# EAGLE design J-ST-Link (EAGLE 9.6.2)
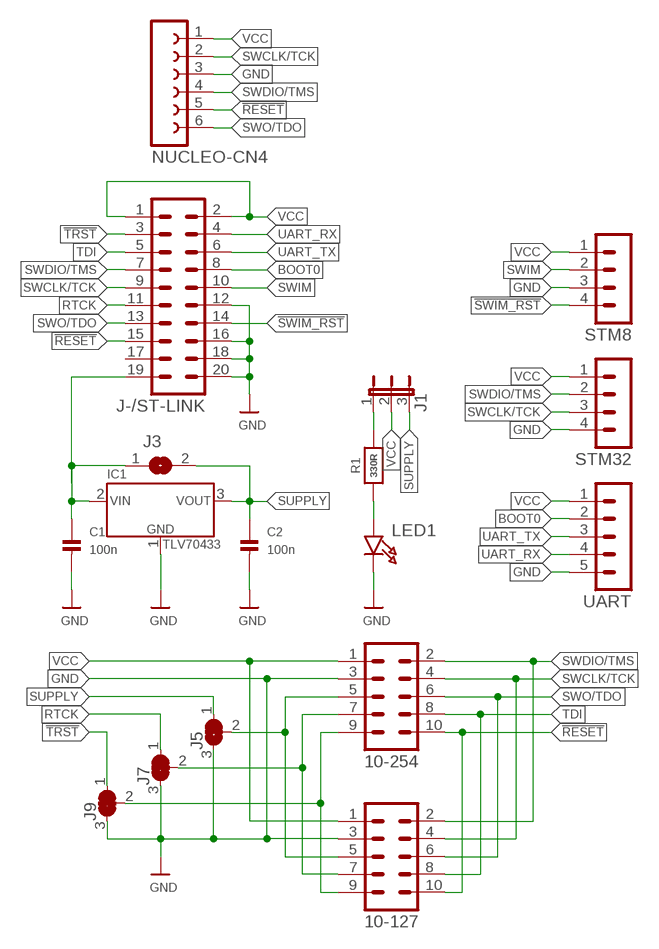
[diagram p0: schematic, sheet 1]

## Parts
10-127  CON-HARTING-ML_ML10S  [CON-HARTING-ML_ML10S]
10-254  ML10  [ML10]
C1  100n  CAP_CERAMIC_0603MP  [_0603MP]
C2  100n  CAP_CERAMIC_0603MP  [_0603MP]
IC1  TLV70433  TLV704XX  [SOT23-5]
J1  JUMPER3LONG  [JUMPER3_LONG]
J3  SOLDERJUMPERSMALL_NOPRINT  [SOLDERJUMPER_SMALL_NOPRINT]
J5  SOLDERJUMPER_2WAY_CLOSED  [SOLDERJUMPER_2WAY_CLOSED_0603]
J7  SOLDERJUMPER_2WAY_CLOSED  [SOLDERJUMPER_2WAY_CLOSED_0603]
J9  SOLDERJUMPER_2WAY_CLOSED  [SOLDERJUMPER_2WAY_CLOSED_0603]
J-/ST-LINK  ML20  [ML20]
LED1  LED0603_NOOUTLINE  [CHIPLED_0603_NOOUTLINE]
NUCLEO-CN4  FE06WSQUARE  [FE06W_SQUARE]
R1  330R  RESISTOR_0603_NOOUT  [0603-NO]
STM8  MA04-1  [MA04-1]
STM32  MA04-1  [MA04-1]
UART  MA05-1  [MA05-1]

## Nets
!RESET: 10-127.10 10-254.10 J-/ST-LINK.15 NUCLEO-CN4.5
!SWIM_RST: J-/ST-LINK.14 STM8.4
!TRST: J9.1 J-/ST-LINK.3
BOOT0: J-/ST-LINK.8 UART.2
GND: 10-127.3 10-254.3 C1.2 C2.2 IC1.1(GND) J5.3 J7.3 J9.3 J-/ST-LINK.12 J-/ST-LINK.16 J-/ST-LINK.18 J-/ST-LINK.20 LED1.C NUCLEO-CN4.3 STM8.3 STM32.4 UART.5
N$36: LED1.A R1.1
N$49: J1.1 R1.2
RTCK: J7.1 J-/ST-LINK.11
RTCK/NC/GND: 10-127.7 10-254.7 J7.2
SUPPLY: C2.1 IC1.3(OUT) J1.3 J3.2 J5.1
SUPPLY/NC/GND: 10-127.5 10-254.5 J5.2
SUPPLY_IN: C1.1 IC1.2(IN) J3.1 J-/ST-LINK.19
SWCLK/TCK: 10-127.4 10-254.4 J-/ST-LINK.9 NUCLEO-CN4.2 STM32.3
SWDIO/TMS: 10-127.2 10-254.2 J-/ST-LINK.7 NUCLEO-CN4.4 STM32.2
SWIM: J-/ST-LINK.10 STM8.2
SWO/TDO: 10-127.6 10-254.6 J-/ST-LINK.13 NUCLEO-CN4.6
TDI: 10-127.8 10-254.8 J-/ST-LINK.5
TRST/NC/GND: 10-127.9 10-254.9 J9.2
UART_RX: J-/ST-LINK.4 UART.4
UART_TX: J-/ST-LINK.6 UART.3
VCC: 10-127.1 10-254.1 J1.2 J-/ST-LINK.1 J-/ST-LINK.2 NUCLEO-CN4.1 STM8.1 STM32.1 UART.1
Unconnected: J-/ST-LINK.17

## Library data of the parts
10-127 = Progger2 (3):CON-HARTING-ML_ML10: HARTING
10-254 = con-harting-ml:ML10: HARTING; OC_FARNELL: unknown; OC_NEWARK: unknown
C1 C2 = microbuilder:CAP_CERAMIC: Ceramic Capacitors 0402 - 0402 Surface Mount Capacitors 16pF 50V 5% [Digikey: 445-4899-2-ND] 18pF 50V 5% [Digikey: 490-1281-2-ND] 22pF 50V 5% [Digikey: 490-1283-2-ND] 68pF 50V 5% [Digikey: 490-1289-2-ND] 0.1uF 10V 10% [Digikey: 490-1318-2-ND] 1.0uF 6.3V 10% [Digikey: 490-1320-2-ND] 0603 - 0603 Surface Mount Capacitors 16 pF 50V 5% [Digikey: 445-5051-2-ND] 22 pF 50V [Digikey: PCC220ACVTR-ND] 33 pF 50V 5% [Digikey: 490-1415-1-ND] 56pF 50V 5% [Digikey: 490-1421-1-ND] 220pF 50V 5% [Digikey: 445-1285-1-ND] 680 pF 50V 2200 pF 50V 5% C0G [Digikey: 445-1297-1-ND] 5600 pF 100V 5% X7R [Digikey: 478-3711-1-ND] 0.1 µF 25V 10% [Digikey: PCC2277TR-ND] 0.22 µF 16V 10% X7R [Digikey: 445-1318-1-ND] 1.0 µF 25V 10% [Digikey: 445-5146-2-ND] 0603 - RF Specific 3pF 250V +/-0.1pF RF [Digikey: 712-1347-1-ND] 18 pF 250V 5% [Digikey: 478-3505-1-ND or 712-1322-1-ND] 56 pF 250V 5% C0G RF [Digikey: 490-4867-1-ND] 68 pF 250V RF [Digikey: 490-4868-1-ND] 0805 - 0805 Surface Mount Capacitors 220 pF 250V 2% RF Ceramic Capacitor [Digikey: 712-1398-1-ND] 1000 pF 50V 2% NP0 Ceramic Capacitor [Digikey: 478-3760-1-ND] 0.1 µF 25V 10% Ceramic Capacitor [Digikey: PCC1828TR-ND] 1.0 µF 16V 10% Ceramic Capacitor[Digikey: 490-1691-2-ND] 10.0 µF 10V 10% Ceramic Capacitor[Digikey: 709-1228-1-ND] 10.0 uF 16V 10% Ceramic Capacitor [Digikey: 478-5165-2-ND] 47 uF 6.3V 20% Ceramic Capacitor [Digikey: 587-1779-1-ND or 399-5506-1-ND] 1206 - 1206 Surface Mount Capacitors 47uF 10V 20% Ceramic Capacitor [Digikey: 490-5528-1-ND or 399-5508-1-ND or 445-6010-1-ND] 100uF 6.3V -20%, +80% Y5V Ceramic Capacitor (Digikey: 490-4512-1-ND, Mouser: 81-GRM31CF50J107ZE1L)
IC1 = microbuilder:TLV704XX
J1 = microbuilder:JUMPER3: JUMPER - 3 Pins
J3 = microbuilder:SOLDERJUMPER: SMD Solder JUMPER Solder the two pads together to create a connection, or remove the solder to break it. REFLOW - Use this footprint for solder paste and reflow ovens. WAVE - Use this footprint for hand-soldering (larger pads). CLOSED - Has a trace between the two pads to ensure it is closed by default. The trace needs to be cut to disable the jumper, and can be closed again by creating a solder bridge between the two pads.
J5 J7 J9 = microbuilder:SOLDERJUMPER_2WAY_CLOSED
J-/ST-LINK = con-harting-ml:ML20: HARTING; OC_FARNELL: unknown; OC_NEWARK: unknown
LED1 = microbuilder:LED: LED 0603 - 0603 Surface Mount Package 2mA: Green LED - Low Power (3.9mcd, 2ma, 1.7Vf) - Digikey: 475-2709-2-ND Orange LED - Low Power (9.8mcd, 2ma, 1.8Vf) - Digikey: 475-1194-2-ND Red LED - Low Power (5mcd, 2ma, 1.8Vf) - Digikey: 475-1195-2-ND Yellow LED - Low Power (7mcd, 2ma, 1.8Vf) - Digikey: 475-1196-2-ND 5mA: Blue LED - Low Power (17mcd, 5ma, 2.9Vf) - Digikey: LNJ937W8CRACT-ND 0805 - 0805 Surface Mount Package 2mA: Red LED (8.8mcd, 2mA, 1.8Vf, Clear) - Low Power [Digikey: 475-2510-1-ND] Green LED (5mcd, 2mA, 1.8Vf, Clear) - Low Power [Digikey: 475-2730-1-ND] Yellow LED (11.3mcd, 2mA, 1.8Vf, Clear) - Low Power [Digikey: 475-2555-1-ND] 20mA: Red LED (104mcd, 20mA, Diffused) - LS R976 [Digikey: 475-1278-6-ND] Red LED (12mcd, 20mA, 2.0Vf, Clear) - APT2012EC [Digikey: 754-1128-1-ND] Green LED (15mcd, 20mA, 2.2Vf, Clear) - APT2012GC [Digikey: 754-1131-1-ND] Orange LED (160mcd, 20mA, 2.1Vf, Clear) - APT2012SECK [Digikey: 754-1130-1-ND] 1206 - 1206 Surface Mount Package Green LED (26mcd, 20mA, Diffused) - LG N971 [Digikey: 475-1407-6-ND] Red LED (15mcd, 20mA, Diffused) - LH N974 [Digikey: 475-1416-6-ND]
NUCLEO-CN4 = con-lsta_edit:FE06W: FEMALE HEADER
R1 = microbuilder:RESISTOR: Resistors For new designs, use the packages preceded by an '_' character since they are more reliable: The following footprints should be used on most boards: _0402 - Standard footprint for regular board layouts _0603 - Standard footprint for regular board layouts _0805 - Standard footprint for regular board layouts _1206 - Standard footprint for regular board layouts For extremely tight-pitch boards where space is at a premium, the following 'micro-pitch' footprints can be used (smaller pads, no silkscreen outline, etc.): _0402MP - Micro-pitch footprint for very dense/compact boards _0603MP - Micro-pitch footprint for very dense/compact boards _0805MP - Micro-pitch footprint for very dense/compact boards _1206MP - Micro-pitch footprint for very dense/compact boards
STM8 STM32 = con-lstb:MA04-1: PIN HEADER; OC_FARNELL: unknown; OC_NEWARK: unknown
UART = con-lstb:MA05-1: PIN HEADER; OC_FARNELL: unknown; OC_NEWARK: unknown

## Board
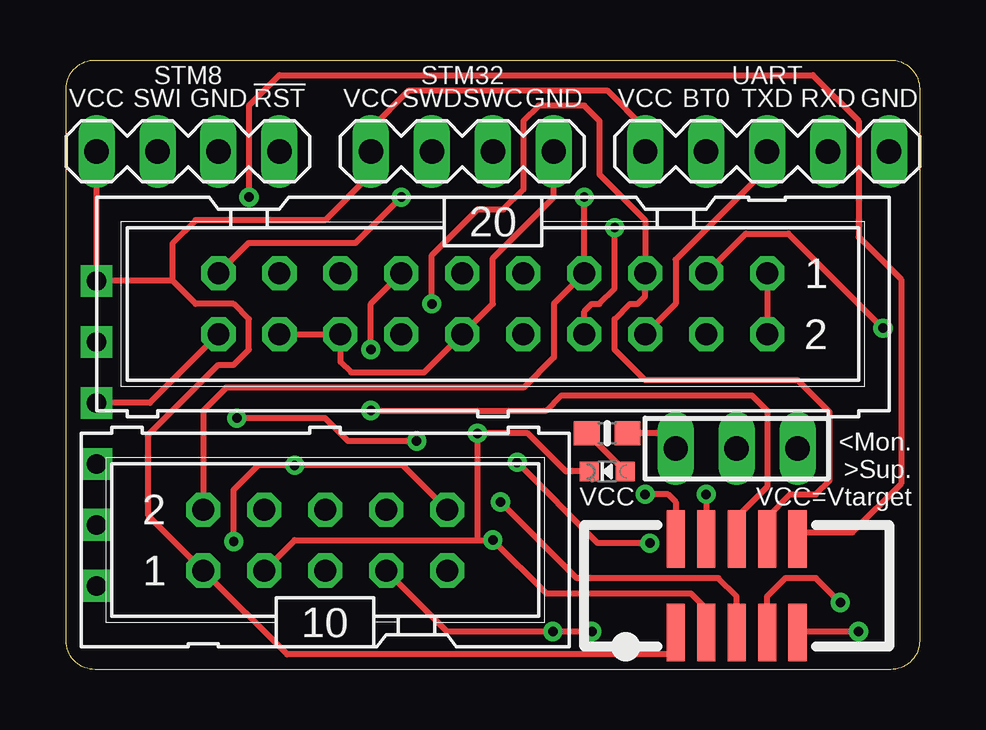
[diagram p1: board, top side]
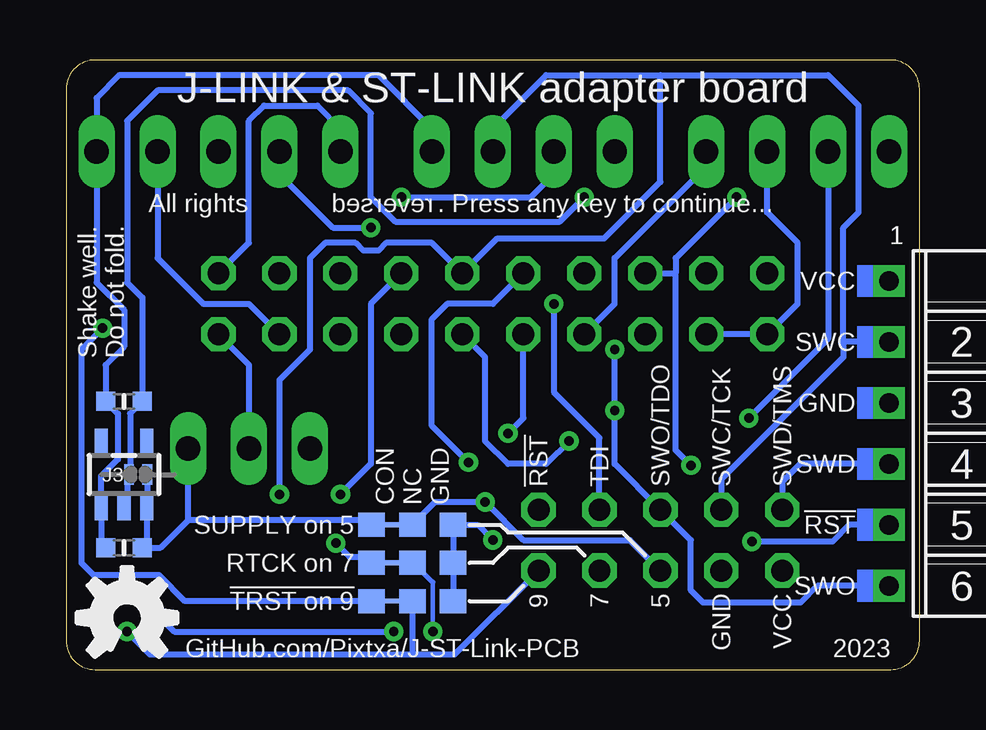
[diagram p2: board, bottom side, seen from below]

Size 35.56 x 25.4 mm. Coordinates in mm from the lower left corner, seen from the top.
Outline: 34.35,25.4 arc-90 35.56,24.19 35.56,1.21 arc-90 34.35,0 1.21,0 arc-90 0,1.21 0,24.19 arc-90 1.21,25.4 34.35,25.4
Copper layers (1*16): Top 0.035mm / dielectric 1.5mm / Bottom 0.035mm
Design rules "adafruit 88": minimum track width 8mil, minimum drill 15.5mil, track to track 8mil, track to pad 8mil, pad to pad 8mil, via to via 8mil, smd to smd 8mil, copper to edge 10mil, drill to drill 8mil, minimum pad ring 10mil, minimum via ring 8mil, stop-mask expansion 2mil, vias tented up to drill 20mil, thermal gap 10mil

### Footprints (pad centres in the part's own frame; a part is rotated, then mirrored left to right if it is on the bottom)
CON-HARTING-ML_ML10S = smd 0.76 x 2.4: 1 -2.54,-1.95; 2 -2.54,1.95; 3 -1.27,-1.95; 4 -1.27,1.95; 5 0,-1.95; 6 0,1.95; 7 1.27,-1.95; 8 1.27,1.95; 9 2.54,-1.95; 10 2.54,1.95
ML10 = drill 0.914 octagon: 1 -5.08,-1.27; 2 -5.08,1.27; 3 -2.54,-1.27; 4 -2.54,1.27; 5 0,-1.27; 6 0,1.27; 7 2.54,-1.27; 8 2.54,1.27; 9 5.08,-1.27; 10 5.08,1.27
_0603MP = smd 0.8 x 0.8: 1 -0.762,0; 2 0.762,0
SOT23-5 = smd 0.55 x 1.2: 1 -0.95,-1.3; 2 0,-1.3; 3 0.95,-1.3; 4 0.95,1.3; 5 -0.95,1.3
JUMPER3_LONG = drill 1.016 long: 1 -2.54,0; 2 0,0; 3 2.54,0
SOLDERJUMPER_SMALL_NOPRINT = smd 0.406 x 0.838: 1 -0.381,0; 2 0.381,0
SOLDERJUMPER_2WAY_CLOSED_0603 = smd 1.1 x 1: 1 -1.7,0; 2 0,0; 3 1.7,0 | smd 1 x 0.203: WIRE -0.85,0
ML20 = drill 0.914 octagon: 1 -11.43,-1.27; 2 -11.43,1.27; 3 -8.89,-1.27; 4 -8.89,1.27; 5 -6.35,-1.27; 6 -6.35,1.27; 7 -3.81,-1.27; 8 -3.81,1.27; 9 -1.27,-1.27; 10 -1.27,1.27; 11 1.27,-1.27; 12 1.27,1.27; 13 3.81,-1.27; 14 3.81,1.27; 15 6.35,-1.27; 16 6.35,1.27; 17 8.89,-1.27; 18 8.89,1.27; 19 11.43,-1.27; 20 11.43,1.27
CHIPLED_0603_NOOUTLINE = smd 0.8 x 0.8: A 0,-0.75; C 0,0.75
FE06W_SQUARE = drill 0.813 square: 1 -6.35,0; 2 -3.81,0; 3 -1.27,0; 4 1.27,0; 5 3.81,0; 6 6.35,0
0603-NO = smd 1.075 x 1: 1 -0.85,0; 2 0.85,0
MA04-1 = drill 1.016 long: 1 -3.81,0; 2 -1.27,0; 3 1.27,0; 4 3.81,0
MA05-1 = drill 1.016 long: 1 -5.08,0; 2 -2.54,0; 3 0,0; 4 2.54,0; 5 5.08,0

### Placement (x,y rotation side)
10-127  27.94,3.49 0 top
10-254  10.79,5.4 0 top
C1  33.15,11.18 180 bottom
C2  33.15,5.08 180 bottom
IC1  33.15,8.13 0 bottom
J1  27.94,9.21 0 top
J3  32.56,8.13 0 bottom
J5  21.13,6.03 0 bottom
J7  21.13,4.45 0 bottom
J9  21.13,2.86 0 bottom
J-/ST-LINK  17.78,15.24 180 top
LED1  22.54,8.26 90 top
NUCLEO-CN4  1.27,9.84 270 bottom
R1  22.54,9.84 0 top
STM8  5.08,21.59 0 top
STM32  16.51,21.59 0 top
UART  29.21,21.59 0 top

### Tracks (layer width: path | path; a pad name or v marks a point on that pad's centre or on a via)
!RESET  (via drill 0.39)
  Top 0.254: v7.62,19.68 7.62,23.5 8.89,24.77 31.11,24.77 33.02,22.86 33.02,18.03 34.8,16.26 34.8,7.75 32.77,5.71 30.48,5.71 10-127.10 | 10-254.10 14.03,8.51 v9.53,8.51 8,8.51 6.99,7.49 v6.99,5.33
  Bottom 0.254: v7.62,19.68 10.16,17.14 10.16,16.51 | J-/ST-LINK.15 10.16,16.51 | v9.53,8.51 10.16,9.14 10.16,16.51 | NUCLEO-CN4.5 2.92,6.03 3.62,5.33 v6.99,5.33
!SWIM_RST
  Bottom 0.254: J-/ST-LINK.14 12.7,15.24 12.7,17.14 9.21,20.64 8.89,20.64 STM8.4
!TRST  (via drill 0.39)
  Top 0.254: J-/ST-LINK.3 28.32,18.16 30.1,18.16 v34.04,14.22
  Bottom 0.254: v34.04,14.22 34.92,13.34 34.92,4.45 34.42,3.94 31.69,3.94 30.61,2.86 J9.1
BOOT0  (via drill 0.39)
  Top 0.254: J-/ST-LINK.8 21.59,14.92 21.91,15.24 22.23,15.24 22.86,15.88 v22.86,18.41
  Bottom 0.254: UART.2 26.67,20.64 24.45,18.41 v22.86,18.41
GND  (via drill 0.39)
  Top 0.254: 10-127.3 26.67,2.54 26.04,3.17 20,3.17 v17.78,5.4 17.14,5.4 | J-/ST-LINK.18 J-/ST-LINK.16 11.43,12.83 11.87,12.38 14.92,12.38 J-/ST-LINK.12 17.78,15.24 17.78,17.14 20.32,19.68 STM32.4 | LED1.C 20.83,8.26 19.24,9.84 v17.14,9.84 17.14,5.4 | J-/ST-LINK.20 3.49,11.11 NUCLEO-CN4.3 | 10-254.3 9.53,5.4 17.14,5.4
  Bottom 0.254: STM8.3 6.35,19.05 5.08,17.78 5.08,15.24 J-/ST-LINK.20 J-/ST-LINK.18 | STM32.4 20.32,22.54 22.54,24.77 33.34,24.77 34.29,23.81 UART.5 34.29,16.13 33.15,14.99 33.15,13.46 33.91,12.7 C1.2 33.4,10.67 33.4,8.76 34.1,8.07 IC1.1 34.1,5.27 C2.2 | v17.14,9.84 16.51,10.48 J-/ST-LINK.12 | v17.78,5.4 18.41,6.03 J5.3 J7.3 J9.3
N$36
  Top 0.254: LED1.A 21.7,9.84 R1.1
N$49
  Top 0.254: R1.2 23.5,9.84 25.4,9.84 J1.1
RTCK  (via drill 0.39)
  Top 0.254: v24.32,5.27 22.16,5.27 v18.8,8.64
  Bottom 0.254: J-/ST-LINK.11 17.78,15.24 19.68,15.24 20.32,14.61 20.32,10.16 v18.8,8.64 | v24.32,5.27 23.75,4.7 23.09,4.7 J7.1
RTCK/NC/GND  (via drill 0.39)
  Top 0.254: v32.26,2.79 31.24,3.81 29.97,3.81 29.21,3.05 10-127.7 | v21.91,1.59 v20.28,1.59 15.88,1.59 10-254.7
  Bottom 0.195: v20.28,1.59 20.28,3.64
  Bottom 0.199: 20.28,3.64 21.08,4.45
  Bottom 0.203: 21.08,4.45 J7.2
  Bottom 0.254: v32.26,2.79 31.05,1.59 v21.91,1.59
SUPPLY
  Bottom 0.254: 30.48,6.22 J1.3 | J3.2 32.18,6.99 32.2,6.97 IC1.3 32.2,5.27 C2.1 31.62,5.08 30.48,6.22 | 30.48,6.22 23.02,6.22 J5.1
SUPPLY/NC/GND  (via drill 0.39)
  Top 0.254: v18.1,6.99 21.27,3.81 27.18,3.81 27.94,3.05 10-127.5
  Bottom 0.254: 10-254.5 12.06,5.4 16.51,5.4 v18.1,6.99 20.18,6.99 J5.2
SUPPLY_IN  (via drill 0.39)
  Top 0.254: J-/ST-LINK.19 7.62,17.78 12.06,17.78 v13.97,19.68
  Bottom 0.254: v13.97,19.68 14.99,18.67 21.84,18.67 22.86,19.68 22.86,23.18 23.81,24.13 31.75,24.13 33.02,22.86 33.02,16.13 32.38,15.49 C1.1 32.89,10.67 32.89,8.18 J3.1 33.02,8.05 33.02,6.96 IC1.2
SWCLK/TCK  (via drill 0.39)
  Top 0.254: v26.67,7.3 10-127.4
  Bottom 0.254: v26.67,7.3 26.67,12.06 25.4,13.34 25.4,17.14 24.77,17.78 23.5,17.78 23.18,17.46 22.54,17.46 22.23,17.78 20.32,17.78 J-/ST-LINK.9 17.59,17.97 13.14,17.97 10.79,20.32 10.79,24.77 | 10.79,24.77 15.56,24.77 17.78,22.54 STM32.3 | 10.79,24.77 3.81,24.77 2.54,23.5 2.54,19.05 3.17,18.41 3.17,13.65 | NUCLEO-CN4.2 3.17,13.65 | 3.17,13.65 3.17,13.02 8.26,7.94 10-254.4
SWDIO/TMS  (via drill 0.39)
  Top 0.254: 10-127.2 25.4,6.99 25.08,7.3 v24.13,7.3 | v21.59,19.68 J-/ST-LINK.7 20.32,15.24 20.32,13.01 19.06,11.75 6.67,11.75 5.71,10.79 10-254.2
  Bottom 0.254: J-/ST-LINK.7 22.86,15.24 22.86,8.57 v24.13,7.3 | v21.59,19.68 16.19,19.68 15.24,20.64 STM32.2 | NUCLEO-CN4.4 4.97,8.57 5.71,7.83 10-254.2
SWIM  (via drill 0.39)
  Top 0.254: v14.61,9.53 11.75,9.53 10.79,10.48 v7.11,10.48
  Bottom 0.254: v14.61,9.53 15.56,8.57 17.14,8.57 18.1,9.53 18.1,13.02 J-/ST-LINK.10 | STM8.2 3.81,13.78 v7.11,10.48
SWO/TDO  (via drill 0.39)
  Top 0.254: 10-127.6 27.94,6.35 29.21,7.62 29.21,10.79 28.57,11.43 20.64,11.43 20,10.79 v12.7,10.79 | J-/ST-LINK.13 12.7,15.24 v12.7,13.34
  Bottom 0.254: v12.7,13.34 v12.7,10.79 12.7,8.57 10-254.6 9.53,5.4 9.53,3.3 9.02,2.79 4.95,2.79 4.25,3.49 NUCLEO-CN4.6
TDI  (via drill 0.39)
  Top 0.254: 10-127.8 29.21,6.35 30.16,7.3 31.24,7.3 31.81,7.87 31.81,10.73 30.48,12.06 24.13,12.06 22.86,13.34 22.86,14.61 23.5,15.24 23.81,15.24 24.13,15.56 J-/ST-LINK.5 24.13,18.73 22.23,20.64 22.23,22.86 21.59,23.5 19.68,23.5 19.05,22.86 19.05,20 18.22,19.18 17.14,19.18 15.24,17.27 v15.24,15.24
  Bottom 0.254: v15.24,15.24 15.24,11.56 13.34,9.65 10-254.8
TRST/NC/GND  (via drill 0.39)
  Top 0.254: v33.02,1.59 30.48,1.59 10-127.9
  Bottom 0.254: v33.02,1.59 32.07,0.64 21.13,0.64 | 21.13,0.64 19.37,0.64 10-254.9 | J9.2 21.13,0.64
UART_RX
  Bottom 0.254: J-/ST-LINK.4 27.94,15.24 29.84,15.24 31.75,17.14 UART.4
UART_TX
  Top 0.254: J-/ST-LINK.6 25.4,15.24 25.4,17.08 29.21,20.89 UART.3
VCC
  Top 0.254: J-/ST-LINK.1 J-/ST-LINK.2 | 10-127.1 25.4,0.64 9.21,0.64 10-254.1 3.43,6.41 3.43,9.78 3.62,9.97 6.35,12.7 6.99,12.7 7.62,13.34 7.62,14.61 6.99,15.24 5.4,15.24 4.45,16.19 | STM8.1 NUCLEO-CN4.1 4.45,16.19 | UART.1 24.13,22.54 22.54,24.13 14.29,24.13 12.7,22.54 STM32.1 12.7,20.64 10.79,18.73 5.4,18.73 4.45,17.78 4.45,16.19
  Bottom 0.254: J-/ST-LINK.2 27.94,12.7 J1.2 | J-/ST-LINK.1 27.94,17.78 27.94,22.86 27.3,23.5 25.08,23.5 24.13,22.54 UART.1

### Text on the board
tPlace: STM8 | STM32 | UART | VCC | SWI | GND | !RST | VCC | SWD | SWC | GND | VCC | BT0 | TXD | RXD | GND | VCC | <Mon. / >Sup. / VCC=Vtarget
bPlace: J-LINK & ST-LINK adapter board | . Press any key to continue... | reversed | All rights | 1 | VCC | Shake well. / Do not fold. | SWC | GND | SWD | SWD/TMS | SWC/TCK | SWO/TDO | TDI | !RST | J3 | CON / NC / GND | !RST | SUPPLY on 5 | RTCK on 7 | SWO | VCC | GND | 5 | 7 | 9 | !TRST on 9 | 2023 | GitHub.com/Pixtxa/J-ST-Link-PCB